# Altium schematic sheet Ticketing_Master.SchDoc
size A4; Author: Mario Dos Santos; Organization: ETML-ES; Address1: Avenue Recordon 1; Address2: 1004 Lausanne; Address3: Switzerland; SheetNumber: 1; SheetTotal: 6
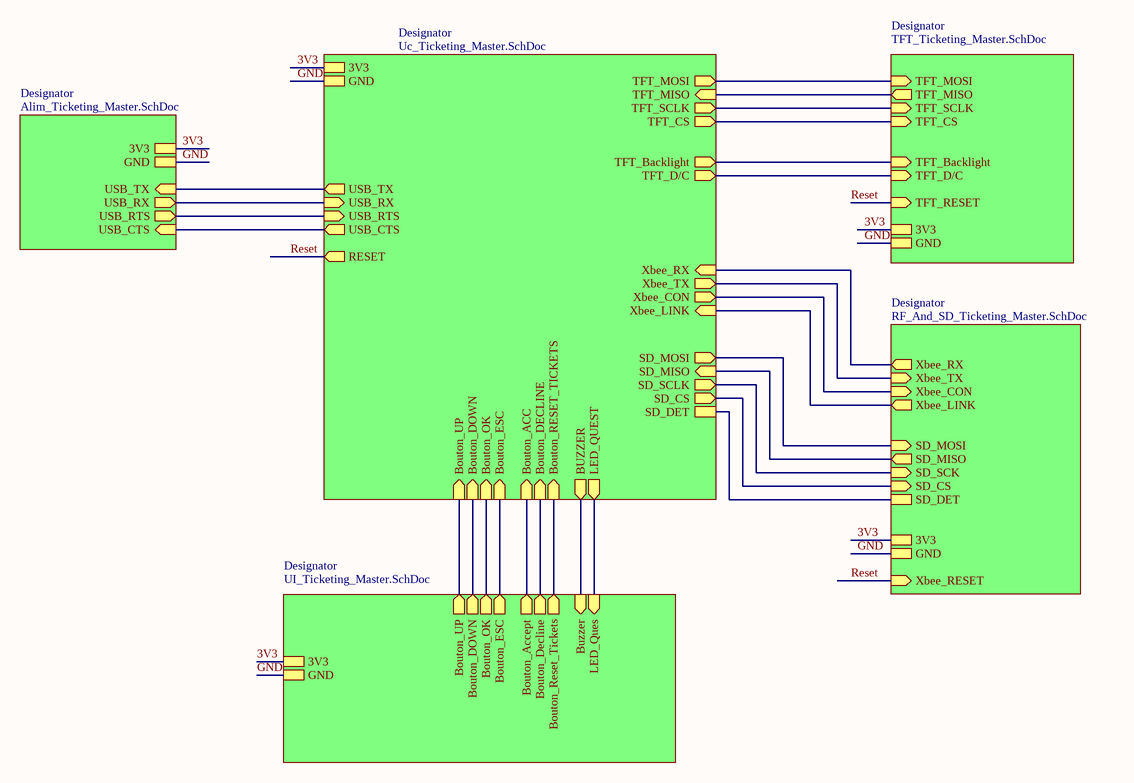
[diagram p0: Ticketing_Master.SchDoc]

## Sub-sheets
Designator = Alim_Ticketing_Master.SchDoc: 3V3, GND, USB_TX (in), USB_RX (out), USB_RTS (out), USB_CTS (in)
Designator = RF_And_SD_Ticketing_Master.SchDoc: Xbee_RX (out), Xbee_TX (in), SD_MISO (out), Xbee_RESET (in), SD_CS (in), SD_MOSI (in), SD_SCK (in), Xbee_CON (in), Xbee_LINK (out), GND, 3V3, SD_DET
Designator = TFT_Ticketing_Master.SchDoc: TFT_MOSI (in), TFT_Backlight (in), TFT_CS (in), TFT_RESET (in), TFT_D/C (in), TFT_MISO (out), TFT_SCLK (in), 3V3, GND
Designator = Uc_Ticketing_Master.SchDoc: 3V3, GND, SD_SCLK (out), TFT_SCLK (out), SD_MOSI (out), SD_MISO (in), Xbee_RX (in), Xbee_TX (out), TFT_MOSI (out), TFT_MISO (in), TFT_Backlight (out), SD_CS (out), TFT_CS (out), TFT_D/C (out), Xbee_CON (out), Xbee_LINK (in), Bouton_UP (in), Bouton_OK (in), Bouton_ESC (in), Bouton_DOWN (in), LED_QUEST (out), BUZZER (out), Bouton_DECLINE (in), Bouton_RESET_TICKETS (in), Bouton_ACC (in), RESET (out), SD_DET, USB_TX (out), USB_RX (in), USB_RTS (in), USB_CTS (out)
Designator = UI_Ticketing_Master.SchDoc: GND, 3V3, Buzzer (in), Bouton_Accept (out), Bouton_UP (out), Bouton_OK (out), LED_Ques (in), Bouton_ESC (out), Bouton_Decline (out), Bouton_Reset_Tickets (out), Bouton_DOWN (out)

## Nets
3V3: sheet Designator/3V3, sheet Designator/3V3, sheet Designator/3V3, sheet Designator/3V3, sheet Designator/3V3
GND: sheet Designator/GND, sheet Designator/GND, sheet Designator/GND, sheet Designator/GND, sheet Designator/GND
Reset: sheet Designator/Xbee_RESET, sheet Designator/TFT_RESET, sheet Designator/RESET
(unnamed): sheet Designator/USB_TX, sheet Designator/USB_TX
(unnamed): sheet Designator/USB_RX, sheet Designator/USB_RX
(unnamed): sheet Designator/USB_RTS, sheet Designator/USB_RTS
(unnamed): sheet Designator/USB_CTS, sheet Designator/USB_CTS
(unnamed): sheet Designator/Xbee_RX, sheet Designator/Xbee_RX
(unnamed): sheet Designator/Xbee_TX, sheet Designator/Xbee_TX
(unnamed): sheet Designator/SD_MISO, sheet Designator/SD_MISO
(unnamed): sheet Designator/SD_CS, sheet Designator/SD_CS
(unnamed): sheet Designator/SD_MOSI, sheet Designator/SD_MOSI
(unnamed): sheet Designator/SD_SCK, sheet Designator/SD_SCLK
(unnamed): sheet Designator/Xbee_CON, sheet Designator/Xbee_CON
(unnamed): sheet Designator/Xbee_LINK, sheet Designator/Xbee_LINK
(unnamed): sheet Designator/SD_DET, sheet Designator/SD_DET
(unnamed): sheet Designator/TFT_MOSI, sheet Designator/TFT_MOSI
(unnamed): sheet Designator/TFT_Backlight, sheet Designator/TFT_Backlight
(unnamed): sheet Designator/TFT_CS, sheet Designator/TFT_CS
(unnamed): sheet Designator/TFT_D/C, sheet Designator/TFT_D/C
(unnamed): sheet Designator/TFT_MISO, sheet Designator/TFT_MISO
(unnamed): sheet Designator/TFT_SCLK, sheet Designator/TFT_SCLK
(unnamed): sheet Designator/Bouton_UP, sheet Designator/Bouton_UP
(unnamed): sheet Designator/Bouton_OK, sheet Designator/Bouton_OK
(unnamed): sheet Designator/Bouton_ESC, sheet Designator/Bouton_ESC
(unnamed): sheet Designator/Bouton_DOWN, sheet Designator/Bouton_DOWN
(unnamed): sheet Designator/LED_QUEST, sheet Designator/LED_Ques
(unnamed): sheet Designator/BUZZER, sheet Designator/Buzzer
(unnamed): sheet Designator/Bouton_DECLINE, sheet Designator/Bouton_Decline
(unnamed): sheet Designator/Bouton_RESET_TICKETS, sheet Designator/Bouton_Reset_Tickets
(unnamed): sheet Designator/Bouton_ACC, sheet Designator/Bouton_Accept

## Notes on the sheet
- Fichier :
- a
- Date :
- Heure :
- Version :
- Auteur :
- Modif.
- b
- c
- d
- Projet :
- No :
- Nb feuilles
- Feuille n°
- Chemin :